# Altium project koosh_sensor_top.PrjPcb
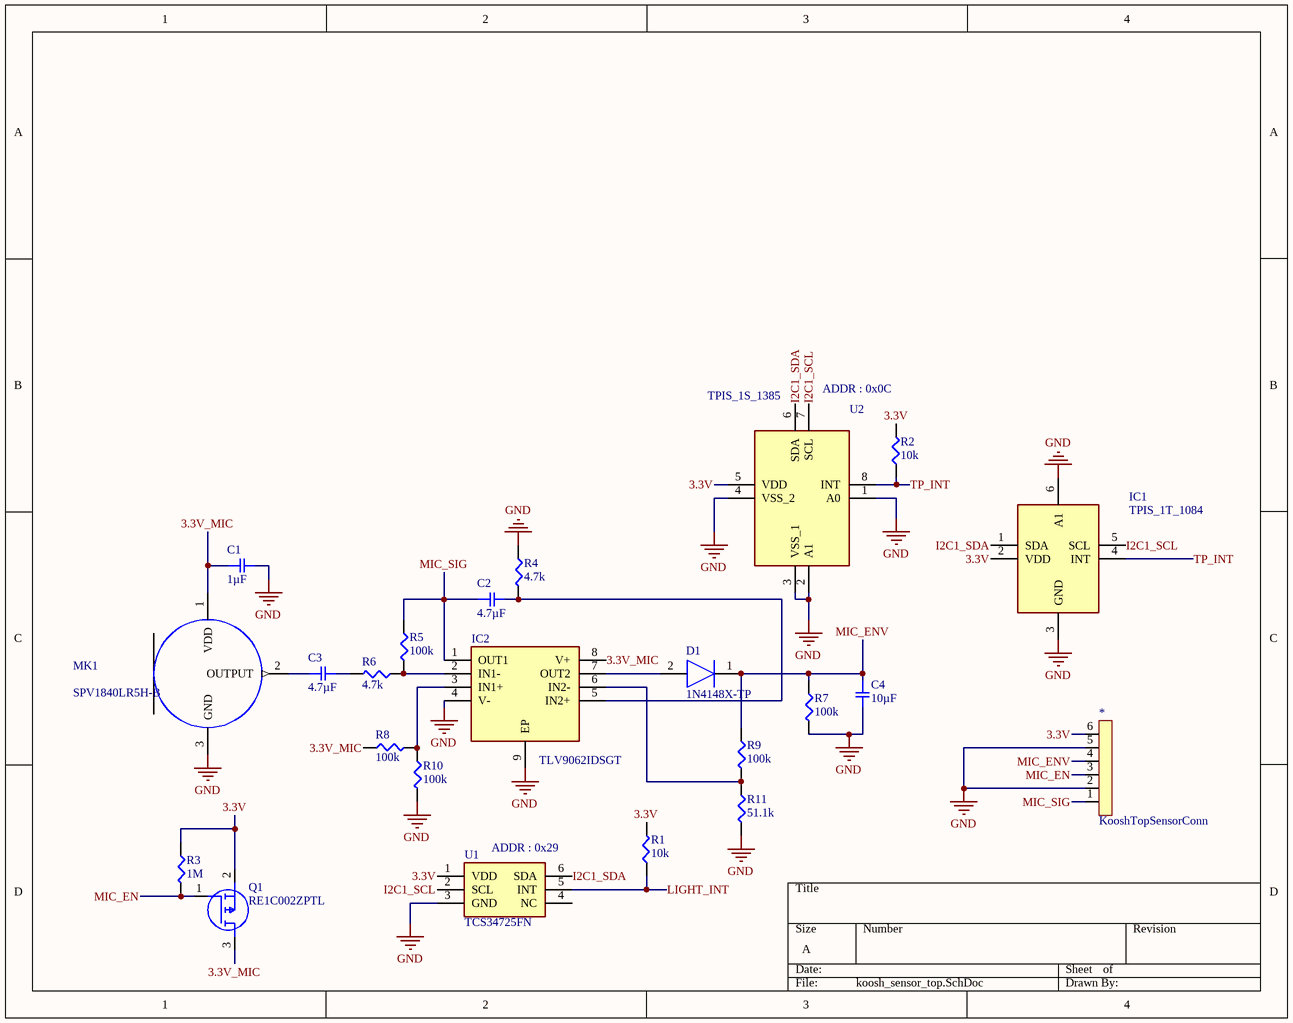
[diagram p0: koosh_sensor_top.SchDoc]
2 sheets, 40 parts. Net scope: global (net labels, ports and power ports of the same name join across sheets).
Board file: koosh_sensor_top_v1_1.PcbDoc
Sheets:
  koosh_sensor_top.SchDoc
  koosh_sensor_top_lighthouse.SchDoc

## Sheet koosh_sensor_top.SchDoc
size A

### Parts
*  KooshTopSensorConn  [KooshTopBoardConn]
C1  1µF  [SMD-0402-RES]
C2  4.7µF  [SMD-0402C]
C3  4.7µF  [SMD-0402C]
C4  10µF  [CAPC1005X55N]
D1  1N4148X-TP  [SODFL1608X70N]
IC1  TPIS_1T_1084  [TPIS1T1084]
IC2  TLV9062IDSGT  [SON50P200X200X80-9N]
MK1  SPV1840LR5H-B  [*MIC_SPV1840LR5H-B]
Q1  RE1C002ZPTL  [SOTFL50P160X85-3N]
R1  10k  [SMD-0402-RES]
R2  10k  [SMD-0402-RES]
R3  1M  [SMD-0402-RES]
R4  4.7k  [SMD-0402-RES]
R5  100k  [SMD-0402-RES]
R6  4.7k  [SMD-0402-RES]
R7  100k  [SMD-0402-RES]
R8  100k  [SMD-0402-RES]
R9  100k  [SMD-0402-RES]
R10  100k  [SMD-0402-RES]
R11  51.1k  [SMD-0402-RES]
U1  TCS34725FN  [FN_1]
U2  TPIS_1S_1385  [TPIS_1S_1385]  (value not drawn)

### Nets
GND: *.2 *.5 C1.2 C4.2 IC1.3(GND) IC1.6(A1) IC2.4(V-) IC2.9(EP) MK1.3(GND) R4.1 R7.2 R10.2 R11.2 U1.3(GND) U2.1(A0) U2.2(A1) U2.3(VSS_1) U2.4(VSS_2)
3.3V: *.6 IC1.2(VDD) Q1.2(S) R1.2 R2.2 R3.1 U1.1(VDD) U2.5(VDD)
3.3V_MIC: C1.1 IC2.8(V+) MK1.1(VDD) Q1.3(D) R8.1
I2C1_SCL: IC1.5(SCL) U1.2(SCL) U2.7(SCL)
I2C1_SDA: IC1.1(SDA) U1.6(SDA) U2.6(SDA)
LIGHT_INT: R1.1 U1.5(INT)
MIC_EN: *.3 Q1.1(G) R3.2
MIC_ENV: *.4 C4.1 D1.1(K) R7.1 R9.1
MIC_SIG: *.1 C2.1 IC2.1(OUT1) R5.1
TP_INT: IC1.4(INT) R2.1 U2.8(INT)
NetC2_2: C2.2 IC2.5(IN2+) R4.2
NetC3_1: C3.1 MK1.2(OUTPUT)
NetC3_2: C3.2 R6.2
NetD1_2: D1.2(A) IC2.7(OUT2)
NetIC2_2: IC2.2(IN1-) R5.2 R6.1
NetIC2_3: IC2.3(IN1+) R8.2 R10.1
NetIC2_6: IC2.6(IN2-) R9.2 R11.1

Not connected (* = marked no-connect by the designer): U1 4(NC)

### Notes on the sheet
- (near U2) TPIS_1S_1385
- ADDR : 0x0C
- (near U1) ADDR : 0x29

### Library data of the parts
C1 = GCM155C71A105KE38D: CAP CER 1UF 10V X7S 0402; Manufacturer: Murata Electronics North America; Factory Stock: 0; Unit Price (USD): 0.12; Minimum Quantity: 1; Tolerance: ±10%; Datasheets: http://www.murata.com/~/media/webrenewal/support/library/catalog/products/capacitor/mlcc/c03e.ashx; Image: //media.digikey.com/Renders/Murata%20Renders/ZRB-SERIES-0402.jpg; Digi-Key Part Number: 490-13409-1-ND; Part Number: GCM155C71A105KE38D; Quantity Available: 7240; @ qty: 0; Packaging: Cut Tape (CT); Series: GCM; Part Status: Active; Value: 1µF; Voltage: 10V; Temperature Coefficient: X7S; Operating Temperature: -55°C ~ 125°C; Features: -; Ratings: AEC-Q200; Applications: Automotive; Mounting Type: Surface Mount, MLCC; Package / Case: 0402 (1005 Metric); Size / Dimension: 0.039" L x 0.020" W (1.00mm x 0.50mm); Height - Seated (Max): -; Thickness (Max): 0.022" (0.55mm); Lead Spacing: -; Lead Style: -
C2 C3 = GRM155R60J475ME47D: CAP CER 4.7UF 6.3V X5R 0402; Manufacturer: Murata Electronics North America; Factory Stock: 0; Unit Price (USD): 0.14; Minimum Quantity: 1; Tolerance: ±20%; Datasheets: http://www.murata.com/~/media/webrenewal/support/library/catalog/products/capacitor/mlcc/c02e.pdf; Image: //media.digikey.com/Renders/Murata%20Renders/ZRB-SERIES-0402.jpg; Digi-Key Part Number: 490-5915-1-ND; Part Number: GRM155R60J475ME47D; Quantity Available: 1963747; @ qty: 0; Packaging: Cut Tape (CT); Series: GRM; Part Status: Active; Value: 4.7µF; Voltage: 6.3V; Temperature Coefficient: X5R; Operating Temperature: -55°C ~ 85°C; Features: Derating Recommended; Ratings: -; Applications: General Purpose; Mounting Type: Surface Mount, MLCC; Package / Case: 0402 (1005 Metric); Size / Dimension: 0.039" L x 0.020" W (1.00mm x 0.50mm); Height - Seated (Max): -; Thickness (Max): 0.024" (0.60mm); Lead Spacing: -; Lead Style: -
C4 = GCM155R71C104KA55D: CAP CER 10UF 16V X7R 0402; Manufacturer: Murata Electronics North America; Factory Stock: 0; Unit Price (USD): 0.1; Minimum Quantity: 1; Tolerance: ±10%; Datasheets: http://www.murata.com/~/media/webrenewal/support/library/catalog/products/capacitor/mlcc/c03e.ashx; Image: //media.digikey.com/Renders/Murata%20Renders/ZRB-SERIES-0402.jpg; Digi-Key Part Number: 490-4759-1-ND; Part Number: GCM155R71C104KA55D; Quantity Available: 734194; @ qty: 0; Packaging: Cut Tape (CT); Series: GCM; Part Status: Active; Value: 10µF; Voltage: 16V; Temperature Coefficient: X7R; Operating Temperature: -55°C ~ 125°C; Features: -; Ratings: AEC-Q200; Applications: Automotive; Mounting Type: Surface Mount, MLCC; Package / Case: 0402 (1005 Metric); Size / Dimension: 0.039" L x 0.020" W (1.00mm x 0.50mm); Height - Seated (Max): -; Thickness (Max): 0.022" (0.55mm); Lead Spacing: -; Lead Style: -
D1 = 1N4148X-TP: Diode; Manufacturer_Name: Micro Commercial Components (MCC); Datasheet Link: http://www.mouser.com/ds/2/258/1N4148X(SOD-523)-349105.pdf; Height: 0.7mm; Manufacturer_Part_Number: 1N4148X-TP; Mouser Part Number: 833-1N4148X-TP; Mouser Price/Stock: https://www.mouser.com/Search/Refine.aspx?Keyword=833-1N4148X-TP
IC1 = TPIS_1T_1084: Integrated Circuit; Manufacturer_Name: Excelitas Technologies; Manufacturer_Part_Number: TPIS 1T 1084; Datasheet Link: http://www.excelitas.com/Downloads/IR_Innovations_Brochure.pdf; Height: 4.5mm
IC2 = TLV9062IDSGT: Integrated Circuit; Manufacturer_Name: Texas Instruments; Datasheet Link: http://www.ti.com/lit/gpn/TLV9062; Height: 0.8mm; Manufacturer_Part_Number: TLV9062IDSGT; Mouser Part Number: 595-TLV9062IDSGT; Mouser Price/Stock: https://www.mouser.com/Search/Refine.aspx?Keyword=595-TLV9062IDSGT
MK1 = SPV1840LR5H-B: Mic Mems Analog; MF: Knowles; MP: SPV1840LR5H-B; Package: 0805 Knowles; SnapEDA_Link: https://www.snapeda.com/parts/SPV1840LR5H-B/Knowles/view-part/?ref=snap; Availability: Unavailable; Price: None; Value: *
Q1 = RE1C002ZPTL: MOSFET (P-Channel); Manufacturer_Name: ROHM Semiconductor; Datasheet Link: https://componentsearchengine.com/Datasheets/1/RE1C002ZPTL.pdf; Height: 0.85mm; Manufacturer_Part_Number: RE1C002ZPTL; Mouser Part Number: 755-RE1C002ZPTL; Mouser Price/Stock: https://www.mouser.com/Search/Refine.aspx?Keyword=755-RE1C002ZPTL; RS Part Number: 1486960P; RS Price/Stock: http://uk.rs-online.com/web/p/products/1486960P
R1 R2 = ERJ-2GEJ103X: RES SMD 10K OHM 5% 1/10W 0402; Manufacturer: Panasonic Electronic Components; Factory Stock: 0; Unit Price (USD): 0.00350; @ qty: 1500; Minimum Quantity: 1; Power (Watts): 0.1W, 1/10W; Temperature Coefficient: ±200ppm/°C; Part Number: ERJ-2GEJ103X; Datasheets: http://industrial.panasonic.com/www-cgi/jvcr13pz.cgi?E+PZ+3+AOA0001+ERJ2GEJ103X+7+WW; Image: //media.digikey.com/Photos/Panasonic%20Photos/ERJ-PA2-Series.jpg; Digi-Key Part Number: P10KJCT-ND; Quantity Available: 2560215; Packaging: Cut Tape (CT); Series: ERJ; Part Status: Active; Value: 10k; Tolerance: ±5%; Composition: Thick Film; Features: Automotive AEC-Q200; Operating Temperature: -55°C ~ 155°C; Package / Case: 0402 (1005 Metric); Supplier Device Package: 0402; Size / Dimension: 0.039" L x 0.020" W (1.00mm x 0.50mm); Height - Seated (Max): 0.016" (0.40mm); Number of Terminations: 2; Failure Rate: -
R3 = ERJ-2GEJ105X: RES SMD 1M OHM 5% 1/10W 0402; Manufacturer: Panasonic Electronic Components; Factory Stock: 0; Unit Price (USD): 0.00350; @ qty: 1500; Minimum Quantity: 1; Power (Watts): 0.1W, 1/10W; Temperature Coefficient: ±200ppm/°C; Part Number: ERJ-2GEJ105X; Datasheets: http://industrial.panasonic.com/www-cgi/jvcr13pz.cgi?E+PZ+3+AOA0001+ERJ2GEJ105X+7+WW; Image: //media.digikey.com/Photos/Panasonic%20Photos/ERJ-PA2-Series.jpg; Digi-Key Part Number: P1.0MJCT-ND; Quantity Available: 1082572; Packaging: Cut Tape (CT); Series: ERJ; Part Status: Active; Value: 1M; Tolerance: ±5%; Composition: Thick Film; Features: Automotive AEC-Q200; Operating Temperature: -55°C ~ 155°C; Package / Case: 0402 (1005 Metric); Supplier Device Package: 0402; Size / Dimension: 0.039" L x 0.020" W (1.00mm x 0.50mm); Height - Seated (Max): 0.016" (0.40mm); Number of Terminations: 2; Failure Rate: -
R4 R6 = ERJ-2GEJ103X: RES SMD 4.7K OHM 5% 1/10W 0402; Manufacturer: Panasonic Electronic Components; Factory Stock: 0; Unit Price (USD): 0.00350; @ qty: 1500; Minimum Quantity: 1; Power (Watts): 0.1W, 1/10W; Temperature Coefficient: ±200ppm/°C; Part Number: ERJ-2GEJ103X; Datasheets: http://industrial.panasonic.com/www-cgi/jvcr13pz.cgi?E+PZ+3+AOA0001+ERJ2GEJ103X+7+WW; Image: //media.digikey.com/Photos/Panasonic%20Photos/ERJ-PA2-Series.jpg; Digi-Key Part Number: P10KJCT-ND; Quantity Available: 2560215; Packaging: Cut Tape (CT); Series: ERJ; Part Status: Active; Value: 4.7k; Tolerance: ±5%; Composition: Thick Film; Features: Automotive AEC-Q200; Operating Temperature: -55°C ~ 155°C; Package / Case: 0402 (1005 Metric); Supplier Device Package: 0402; Size / Dimension: 0.039" L x 0.020" W (1.00mm x 0.50mm); Height - Seated (Max): 0.016" (0.40mm); Number of Terminations: 2; Failure Rate: -
R5 R7-R10 = ERJ-2GEJ103X: RES SMD 100K OHM 5% 1/10W 0402; Manufacturer: Panasonic Electronic Components; Factory Stock: 0; Unit Price (USD): 0.00350; @ qty: 1500; Minimum Quantity: 1; Power (Watts): 0.1W, 1/10W; Temperature Coefficient: ±200ppm/°C; Part Number: ERJ-2GEJ103X; Datasheets: http://industrial.panasonic.com/www-cgi/jvcr13pz.cgi?E+PZ+3+AOA0001+ERJ2GEJ103X+7+WW; Image: //media.digikey.com/Photos/Panasonic%20Photos/ERJ-PA2-Series.jpg; Digi-Key Part Number: P10KJCT-ND; Quantity Available: 2560215; Packaging: Cut Tape (CT); Series: ERJ; Part Status: Active; Value: 100k; Tolerance: ±5%; Composition: Thick Film; Features: Automotive AEC-Q200; Operating Temperature: -55°C ~ 155°C; Package / Case: 0402 (1005 Metric); Supplier Device Package: 0402; Size / Dimension: 0.039" L x 0.020" W (1.00mm x 0.50mm); Height - Seated (Max): 0.016" (0.40mm); Number of Terminations: 2; Failure Rate: -
R11 = ERJ-2GEJ103X: RES SMD 51.1K OHM 5% 1/10W 0402; Manufacturer: Panasonic Electronic Components; Factory Stock: 0; Unit Price (USD): 0.00350; @ qty: 1500; Minimum Quantity: 1; Power (Watts): 0.1W, 1/10W; Temperature Coefficient: ±200ppm/°C; Part Number: ERJ-2GEJ103X; Datasheets: http://industrial.panasonic.com/www-cgi/jvcr13pz.cgi?E+PZ+3+AOA0001+ERJ2GEJ103X+7+WW; Image: //media.digikey.com/Photos/Panasonic%20Photos/ERJ-PA2-Series.jpg; Digi-Key Part Number: P10KJCT-ND; Quantity Available: 2560215; Packaging: Cut Tape (CT); Series: ERJ; Part Status: Active; Value: 51.1k; Tolerance: ±5%; Composition: Thick Film; Features: Automotive AEC-Q200; Operating Temperature: -55°C ~ 155°C; Package / Case: 0402 (1005 Metric); Supplier Device Package: 0402; Size / Dimension: 0.039" L x 0.020" W (1.00mm x 0.50mm); Height - Seated (Max): 0.016" (0.40mm); Number of Terminations: 2; Failure Rate: -
U1 = TCS34725FN: Undefined or Miscellaneous; Manufacturer_Name: ams; Datasheet Link: https://ams.com/jpn/content/download/319364/1117183/file/TCS3472_Datasheet_EN_v2.pdf; Manufacturer_Part_Number: TCS34725FN; Mouser Part Number: 985-TCS34725FN; Mouser Price/Stock: https://www.mouser.com/Search/Refine.aspx?Keyword=985-TCS34725FN; RS Part Number: 1024173P; RS Price/Stock: http://china.rs-online.com/web/p/products/1024173P
U2 = TPIS_1S_1385: Undefined or Miscellaneous; Manufacturer_Name: Excelitas Technologies; Manufacturer_Part_Number: TPIS 1S 1385; Datasheet Link: http://media.digikey.com/pdf/Data%20Sheets/Excelitas%20PDFs/TPiS_1S_1385.pdf

## Sheet koosh_sensor_top_lighthouse.SchDoc
size A
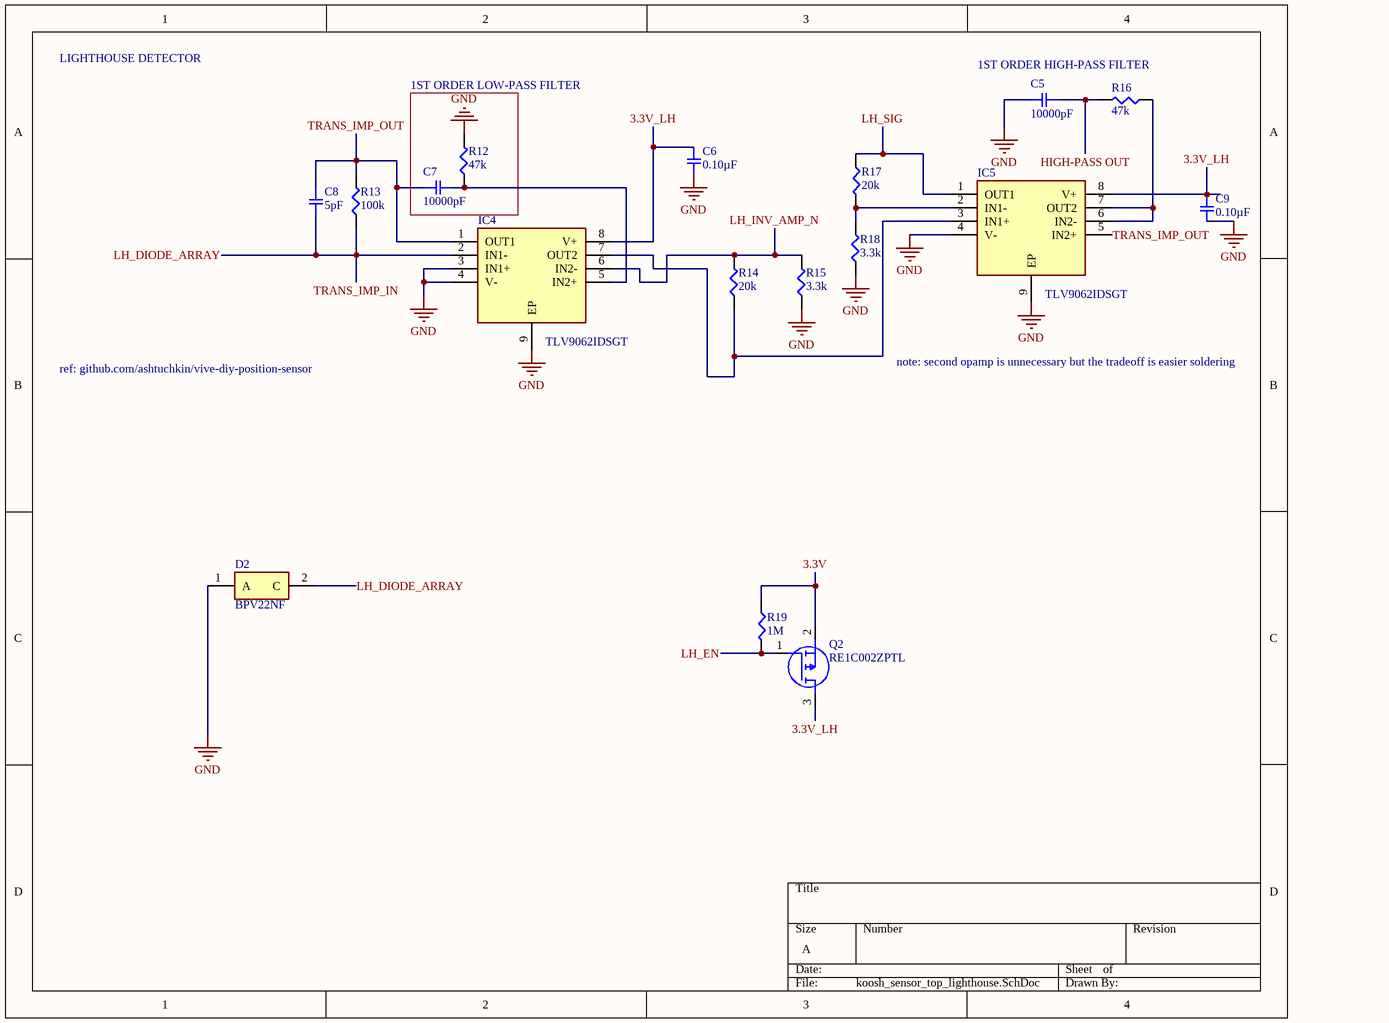
[diagram p1: koosh_sensor_top_lighthouse.SchDoc]

### Parts
C5  10000pF  [SMD-0402C]
C6  0.10µF  [SMD-0402C]
C7  10000pF  [SMD-0402C]
C8  5pF  [SMD-0402C]
C9  0.10µF  [SMD-0402C]
D2  BPV22NF  [TO254P510X450X920-2P]
IC4  TLV9062IDSGT  [SON50P200X200X80-9N]
IC5  TLV9062IDSGT  [SON50P200X200X80-9N]
Q2  RE1C002ZPTL  [SOTFL50P160X85-3N]
R12  47k  [SMD-0402-RES]
R13  100k  [SMD-0402-RES]
R14  20k  [SMD-0402-RES]
R15  3.3k  [SMD-0402-RES]
R16  47k  [SMD-0402-RES]
R17  20k  [SMD-0402-RES]
R18  3.3k  [SMD-0402-RES]
R19  1M  [SMD-0402-RES]

### Blocks framed on the sheet
1ST ORDER LOW-PASS FILTER: C7 R12

### Nets
GND: C5.2 C6.2 C9.2 D2.1(A) IC4.3(IN1+) IC4.4(V-) IC4.9(EP) IC5.4(V-) IC5.9(EP) R12.2 R15.1 R18.1
3.3V: Q2.2(S) R19.1
3.3V_LH: C6.1 C9.1 IC4.8(V+) IC5.8(V+) Q2.3(D)
HIGH-PASS OUT: C5.1 R16.2
LH_DIODE_ARRAY: C8.2 D2.2(C) IC4.2(IN1-) R13.1  [also labelled TRANS_IMP_IN]
LH_EN: Q2.1(G) R19.2
LH_INV_AMP_N: IC4.6(IN2-) R14.2 R15.2
LH_SIG: IC5.1(OUT1) R17.1
TRANS_IMP_OUT: C7.1 C8.1 IC4.1(OUT1) IC5.5(IN2+) R13.2
NetC7_2: C7.2 IC4.5(IN2+) R12.1
NetIC4_7: IC4.7(OUT2) IC5.3(IN1+) R14.1
NetIC5_2: IC5.2(IN1-) R17.2 R18.2
NetIC5_6: IC5.6(IN2-) IC5.7(OUT2) R16.1

### Notes on the sheet
- LIGHTHOUSE DETECTOR
- 1ST ORDER HIGH-PASS FILTER
- ref: github.com/ashtuchkin/vive-diy-position-sensor
- note: second opamp is unnecessary but the tradeoff is easier soldering

### Library data of the parts
C5 C7 = GCM155R71H103KA55D: CAP CER 10000PF 50V X7R 0402; Manufacturer: Murata Electronics North America; Factory Stock: 0; Unit Price (USD): 0.1; Minimum Quantity: 1; Tolerance: ±10%; Datasheets: http://www.murata.com/~/media/webrenewal/support/library/catalog/products/capacitor/mlcc/c03e.ashx; Image: //media.digikey.com/Renders/Murata%20Renders/ZRB-SERIES-0402.jpg; Digi-Key Part Number: 490-4762-1-ND; Part Number: GCM155R71H103KA55D; Quantity Available: 650067; @ qty: 0; Packaging: Cut Tape (CT); Series: GCM; Part Status: Active; Value: 10000pF; Voltage: 50V; Temperature Coefficient: X7R; Operating Temperature: -55°C ~ 125°C; Features: -; Ratings: AEC-Q200; Applications: Automotive; Mounting Type: Surface Mount, MLCC; Package / Case: 0402 (1005 Metric); Size / Dimension: 0.039" L x 0.020" W (1.00mm x 0.50mm); Height - Seated (Max): -; Thickness (Max): 0.022" (0.55mm); Lead Spacing: -; Lead Style: -
C6 C9 = GCM155R71C104KA55D: CAP CER 0.1UF 16V X7R 0402; Manufacturer: Murata Electronics North America; Factory Stock: 0; Unit Price (USD): 0.1; Minimum Quantity: 1; Tolerance: ±10%; Datasheets: http://www.murata.com/~/media/webrenewal/support/library/catalog/products/capacitor/mlcc/c03e.ashx; Image: //media.digikey.com/Renders/Murata%20Renders/ZRB-SERIES-0402.jpg; Digi-Key Part Number: 490-4759-1-ND; Part Number: GCM155R71C104KA55D; Quantity Available: 734194; @ qty: 0; Packaging: Cut Tape (CT); Series: GCM; Part Status: Active; Value: 0.10µF; Voltage: 16V; Temperature Coefficient: X7R; Operating Temperature: -55°C ~ 125°C; Features: -; Ratings: AEC-Q200; Applications: Automotive; Mounting Type: Surface Mount, MLCC; Package / Case: 0402 (1005 Metric); Size / Dimension: 0.039" L x 0.020" W (1.00mm x 0.50mm); Height - Seated (Max): -; Thickness (Max): 0.022" (0.55mm); Lead Spacing: -; Lead Style: -
C8 = GJM1555C1H5R0BB01D: CAP CER 5PF 50V NP0 0402; Manufacturer: Murata Electronics North America; Factory Stock: 0; Unit Price (USD): 0.2; Minimum Quantity: 1; Tolerance: ±0.1pF; Temperature Coefficient: C0G, NP0; Datasheets: http://www.murata.com/~/media/webrenewal/support/library/catalog/products/capacitor/mlcc/c02e.pdf; Image: //media.digikey.com/Renders/Murata%20Renders/ZRB-SERIES-0402.jpg; Digi-Key Part Number: 490-8103-1-ND; Part Number: GJM1555C1H5R0BB01D; Quantity Available: 17055; @ qty: 0; Packaging: Cut Tape (CT); Series: GJM; Part Status: Active; Value: 5pF; Voltage: 50V; Operating Temperature: -55°C ~ 125°C; Features: High Q, Low Loss; Ratings: -; Applications: RF, Microwave, High Frequency; Mounting Type: Surface Mount, MLCC; Package / Case: 0402 (1005 Metric); Size / Dimension: 0.039" L x 0.020" W (1.00mm x 0.50mm); Height - Seated (Max): -; Thickness (Max): 0.022" (0.55mm); Lead Spacing: -; Lead Style: -
D2 = BPV22NF: Diode; Manufacturer_Name: Vishay; Allied_Number: R1086877; Datasheet Link: http://www.vishay.com/docs/81509/bpv22nf.pdf; Height: 5.1mm; Manufacturer_Part_Number: BPV22NF; Mouser Part Number: 782-BPV22NF; Mouser Price/Stock: https://www.mouser.com/Search/Refine.aspx?Keyword=782-BPV22NF; RS Part Number: 6997604P; RS Price/Stock: http://uk.rs-online.com/web/p/products/6997604P; Allied Price/Stock: https://www.alliedelec.com/vishay-dale-bpv22nf/R1086877/
IC4 IC5 = TLV9062IDSGT: as IC2 on sheet koosh_sensor_top; Datasheet Link: http://www.ti.com/lit/gpn/TLV9062; Height: 0.8mm; Manufacturer_Part_Number: TLV9062IDSGT; Mouser Part Number: 595-TLV9062IDSGT; Mouser Price/Stock: https://www.mouser.com/Search/Refine.aspx?Keyword=595-TLV9062IDSGT
Q2 = RE1C002ZPTL: as Q1 on sheet koosh_sensor_top; Datasheet Link: https://componentsearchengine.com/Datasheets/1/RE1C002ZPTL.pdf; Height: 0.85mm; Manufacturer_Part_Number: RE1C002ZPTL; Mouser Part Number: 755-RE1C002ZPTL; Mouser Price/Stock: https://www.mouser.com/Search/Refine.aspx?Keyword=755-RE1C002ZPTL; RS Part Number: 1486960P; RS Price/Stock: http://uk.rs-online.com/web/p/products/1486960P
R12 R16 = ERJ-2GEJ473X: RES SMD 47K OHM 5% 1/10W 0402; Manufacturer: Panasonic Electronic Components; Factory Stock: 0; Unit Price (USD): 0.00350; @ qty: 1500; Minimum Quantity: 1; Power (Watts): 0.1W, 1/10W; Temperature Coefficient: ±200ppm/°C; Part Number: ERJ-2GEJ473X; Datasheets: http://industrial.panasonic.com/www-cgi/jvcr13pz.cgi?E+PZ+3+AOA0001+ERJ2GEJ473X+7+WW; Image: //media.digikey.com/Photos/Panasonic%20Photos/ERJ-PA2-Series.jpg; Digi-Key Part Number: P47KJCT-ND; Quantity Available: 5182645; Packaging: Cut Tape (CT); Series: ERJ; Part Status: Active; Value: 47k; Tolerance: ±5%; Composition: Thick Film; Features: Automotive AEC-Q200; Operating Temperature: -55°C ~ 155°C; Package / Case: 0402 (1005 Metric); Supplier Device Package: 0402; Size / Dimension: 0.039" L x 0.020" W (1.00mm x 0.50mm); Height - Seated (Max): 0.016" (0.40mm); Number of Terminations: 2; Failure Rate: -
R13 = ERJ-2GEJ104X: RES SMD 100K OHM 5% 1/10W 0402; Manufacturer: Panasonic Electronic Components; Factory Stock: 0; Unit Price (USD): 0.00350; @ qty: 1500; Minimum Quantity: 1; Power (Watts): 0.1W, 1/10W; Temperature Coefficient: ±200ppm/°C; Part Number: ERJ-2GEJ104X; Datasheets: http://industrial.panasonic.com/www-cgi/jvcr13pz.cgi?E+PZ+3+AOA0001+ERJ2GEJ104X+7+WW; Image: //media.digikey.com/Photos/Panasonic%20Photos/ERJ-PA2-Series.jpg; Digi-Key Part Number: P100KJCT-ND; Quantity Available: 2387986; Packaging: Cut Tape (CT); Series: ERJ; Part Status: Active; Value: 100k; Tolerance: ±5%; Composition: Thick Film; Features: Automotive AEC-Q200; Operating Temperature: -55°C ~ 155°C; Package / Case: 0402 (1005 Metric); Supplier Device Package: 0402; Size / Dimension: 0.039" L x 0.020" W (1.00mm x 0.50mm); Height - Seated (Max): 0.016" (0.40mm); Number of Terminations: 2; Failure Rate: -
R14 R17 = ERJ-2GEJ473X: RES SMD 20K OHM 5% 1/10W 0402; Manufacturer: Panasonic Electronic Components; Factory Stock: 0; Unit Price (USD): 0.00350; @ qty: 1500; Minimum Quantity: 1; Power (Watts): 0.1W, 1/10W; Temperature Coefficient: ±200ppm/°C; Part Number: ERJ-2GEJ473X; Datasheets: http://industrial.panasonic.com/www-cgi/jvcr13pz.cgi?E+PZ+3+AOA0001+ERJ2GEJ473X+7+WW; Image: //media.digikey.com/Photos/Panasonic%20Photos/ERJ-PA2-Series.jpg; Digi-Key Part Number: P47KJCT-ND; Quantity Available: 5182645; Packaging: Cut Tape (CT); Series: ERJ; Part Status: Active; Value: 20k; Tolerance: ±5%; Composition: Thick Film; Features: Automotive AEC-Q200; Operating Temperature: -55°C ~ 155°C; Package / Case: 0402 (1005 Metric); Supplier Device Package: 0402; Size / Dimension: 0.039" L x 0.020" W (1.00mm x 0.50mm); Height - Seated (Max): 0.016" (0.40mm); Number of Terminations: 2; Failure Rate: -
R15 R18 = ERJ-2GEJ332X: RES SMD 3.3K OHM 5% 1/10W 0402; Manufacturer: Panasonic Electronic Components; Factory Stock: 0; Unit Price (USD): 0.00350; @ qty: 1500; Minimum Quantity: 1; Power (Watts): 0.1W, 1/10W; Temperature Coefficient: ±200ppm/°C; Part Number: ERJ-2GEJ332X; Datasheets: http://industrial.panasonic.com/www-cgi/jvcr13pz.cgi?E+PZ+3+AOA0001+ERJ2GEJ332X+7+WW; Image: //media.digikey.com/Photos/Panasonic%20Photos/ERJ-PA2-Series.jpg; Digi-Key Part Number: P3.3KJCT-ND; Quantity Available: 514266; Packaging: Cut Tape (CT); Series: ERJ; Part Status: Active; Value: 3.3k; Tolerance: ±5%; Composition: Thick Film; Features: Automotive AEC-Q200; Operating Temperature: -55°C ~ 155°C; Package / Case: 0402 (1005 Metric); Supplier Device Package: 0402; Size / Dimension: 0.039" L x 0.020" W (1.00mm x 0.50mm); Height - Seated (Max): 0.016" (0.40mm); Number of Terminations: 2; Failure Rate: -
R19 = ERJ-2GEJ105X: as R3 on sheet koosh_sensor_top; Part Number: ERJ-2GEJ105X; Datasheets: http://industrial.panasonic.com/www-cgi/jvcr13pz.cgi?E+PZ+3+AOA0001+ERJ2GEJ105X+7+WW; Image: //media.digikey.com/Photos/Panasonic%20Photos/ERJ-PA2-Series.jpg; Digi-Key Part Number: P1.0MJCT-ND; Quantity Available: 1082572; Packaging: Cut Tape (CT); Series: ERJ; Part Status: Active; Value: 1M; Tolerance: ±5%; Composition: Thick Film; Features: Automotive AEC-Q200; Operating Temperature: -55°C ~ 155°C; Package / Case: 0402 (1005 Metric); Supplier Device Package: 0402; Size / Dimension: 0.039" L x 0.020" W (1.00mm x 0.50mm); Height - Seated (Max): 0.016" (0.40mm); Number of Terminations: 2; Failure Rate: -

## Nets that join several sheets
GND: koosh_sensor_top (18 pins), koosh_sensor_top_lighthouse (12 pins)
3.3V: koosh_sensor_top (8 pins), koosh_sensor_top_lighthouse (Q2.2 R19.1)